# EAGLE design VC8Evrs2 (EAGLE 6.6.0)

## Sheet 1 of 2
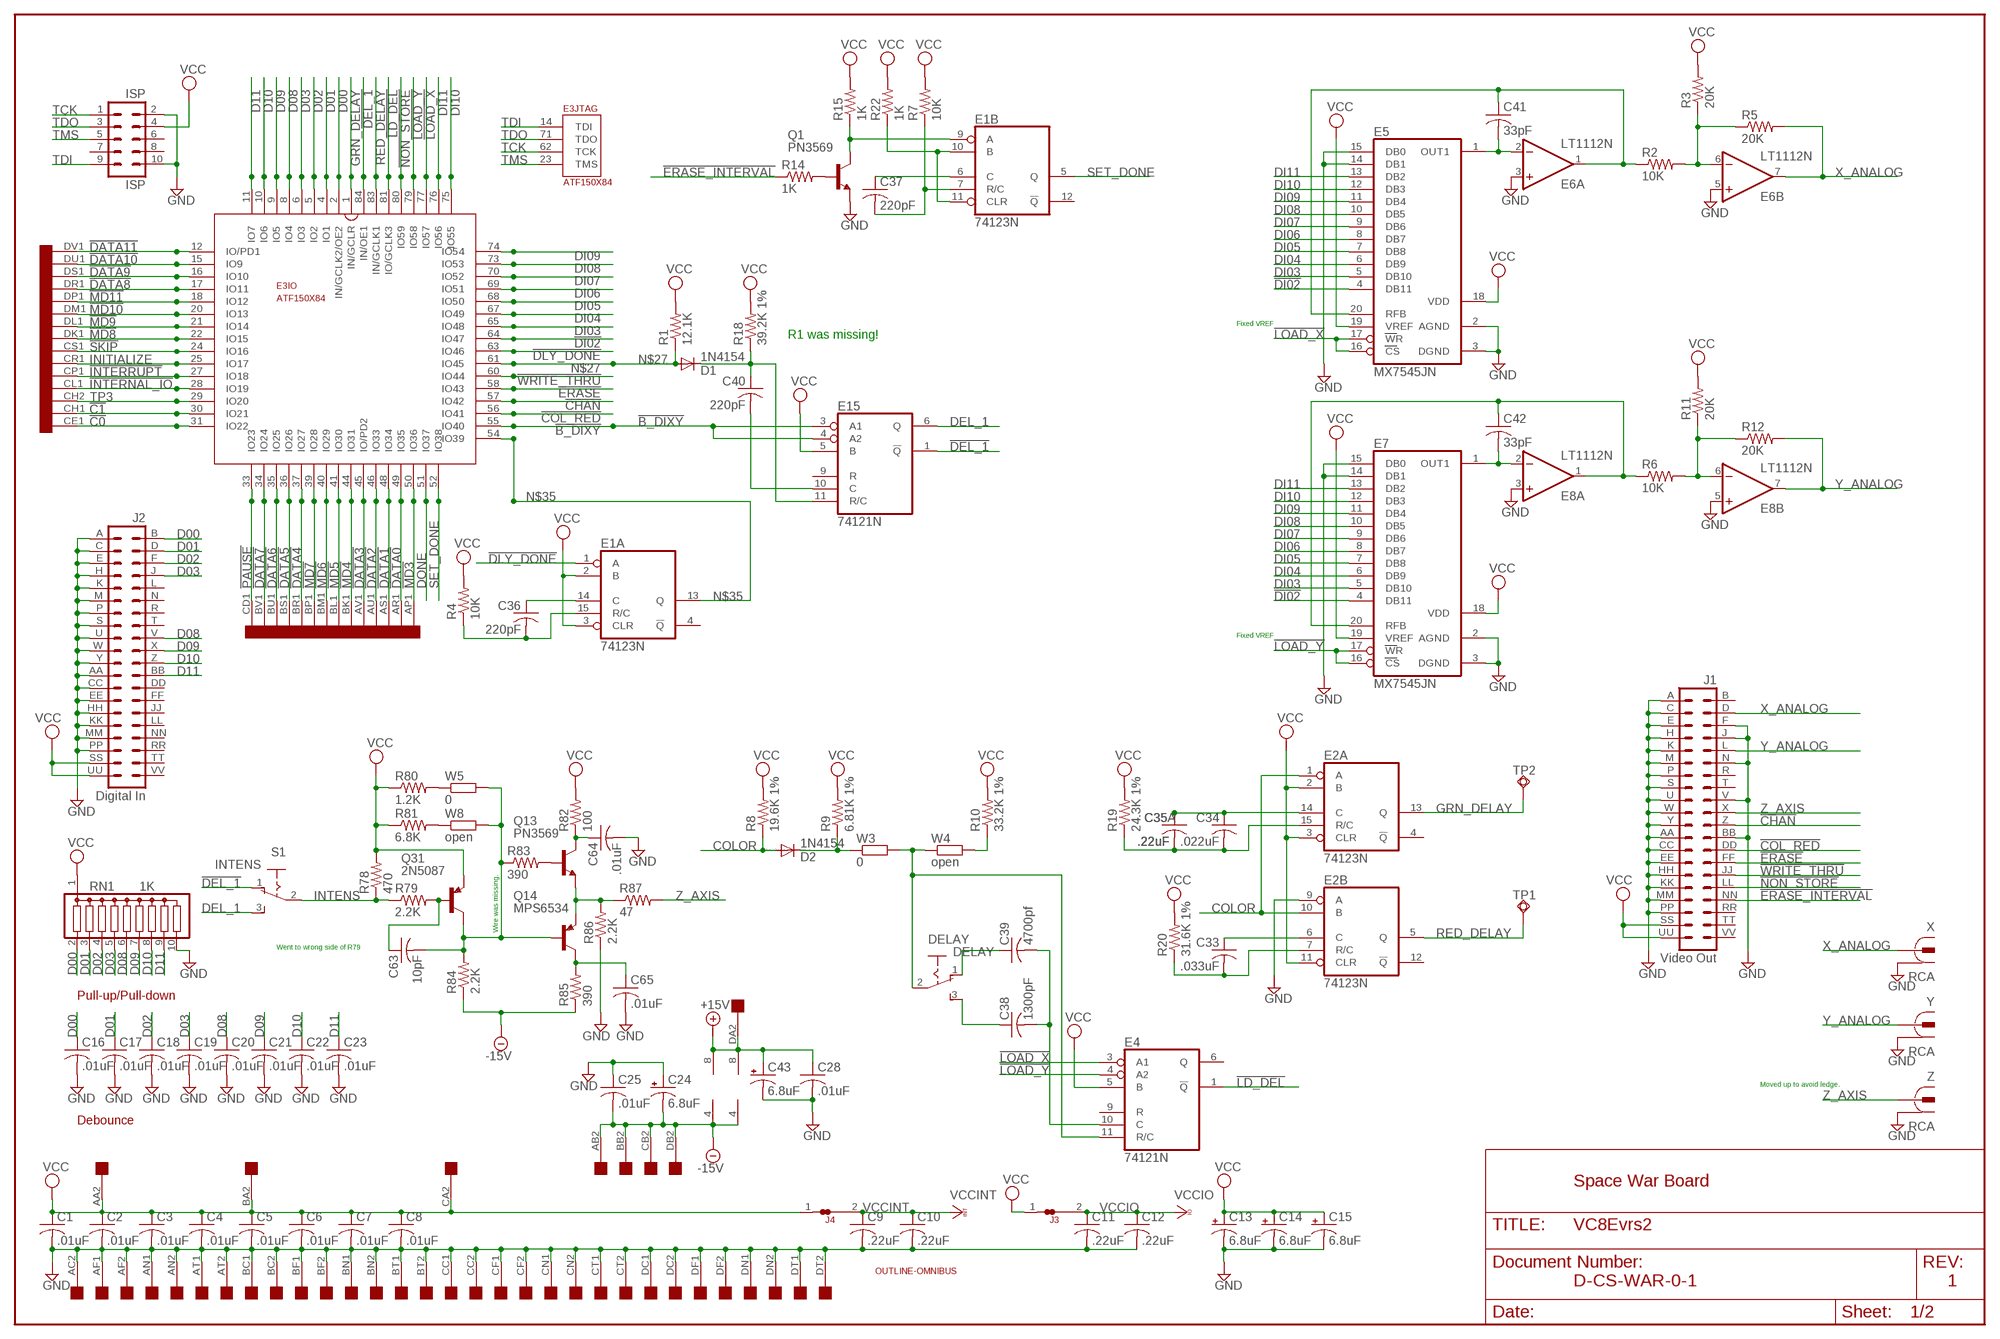
[diagram p0: schematic, sheet 1]

### Parts
C1  .01uF  C-US  [C063-025X075]
C2  .01uF  C-US  [C063-025X075]
C3  .01uF  C-US  [C063-025X075]
C4  .01uF  C-US  [C063-025X075]
C5  .01uF  C-US  [C063-025X075]
C6  .01uF  C-US  [C063-025X075]
C7  .01uF  C-US  [C063-025X075]
C8  .01uF  C-US  [C063-025X075]
C9  .22uF  C-US  [C063-025X075]
C10  .22uF  C-US  [C063-025X075]
C11  .22uF  C-US  [C063-025X075]
C12  .22uF  C-US  [C063-025X075]
C13  6.8uF  CPOL-USE20-8AXIAL  [E12-8]
C14  6.8uF  CPOL-USE20-8AXIAL  [E12-8]
C15  6.8uF  CPOL-USE20-8AXIAL  [E12-8]
C16  .01uF  C-US  [C063-025X075]
C17  .01uF  C-US  [C063-025X075]
C18  .01uF  C-US  [C063-025X075]
C19  .01uF  C-US  [C063-025X075]
C20  .01uF  C-US  [C063-025X075]
C21  .01uF  C-US  [C063-025X075]
C22  .01uF  C-US  [C063-025X075]
C23  .01uF  C-US  [C063-025X075]
C24  6.8uF  CPOL-USE20-8AXIAL  [E12-8]
C25  .01uF  C-US  [C063-025X075]
C28  .01uF  C-US  [C063-025X075]
C33  .033uF  C-US102-043X133  [C102-043X133]
C34  .022uF  C-US102-043X133  [C102-043X133]
C35  .22uF  C-US050-025X075  [C050-025X075]
C35A  .22uF  C-US102-043X133  [C102-043X133]
C36  220pF  C-US  [C063-025X075]
C37  220pF  C-US  [C063-025X075]
C38  1300pF  C-US150-054X183  [C150-054X183]
C39  4700pf  C-US102-043X133  [C102-043X133]
C40  220pF  C-US  [C063-025X075]
C41  33pF  C-US  [C063-025X075]
C42  33pF  C-US  [C063-025X075]
C43  6.8uF  CPOL-USE20-8AXIAL  [E12-8]
C63  10pF  C-US  [C063-025X075]
C64  .01uF  C-US  [C063-025X075]
C65  .01uF  C-US  [C063-025X075]
D1  1N4154  DIODE-DO35-10  [DO35-10]
D2  1N4154  DIODE-DO35-10  [DO35-10]
DELAY  DELAY  M251  [M251]
E1  74123N  [DIL16]
E2  74123N  [DIL16]
E3  ATF150X84  [S84]
E4  74121N  [DIL14]
E5  MX7545JN  [DIL20]
E6  LT1112N  LM1458N  [DIL08]
E7  MX7545JN  [DIL20]
E8  LT1112N  LM1458N  [DIL08]
E15  74121N  [DIL14]
ISP  ISP  ML10  [ML10]
J1  Video Out  DEC40PINH  [DEC40PINH]
J2  Digital In  DEC40PINH  [DEC40PINH]
J3  JUMPER-NC1  [NC1]
J4  JUMPER-NC1  [NC1]
OMNIBUS  QUAD  [EDGE-CON8]
Q1  PN3569  -NPN-TO5  [TO5]
Q13  PN3569  -NPN-TO5  [TO5]
Q14  MPS6534  -PNP-TO5  [TO5]
Q31  2N5087  -PNP-TO5  [TO5]
R1  12.1K  R-US_0207/15  [0207/15]
R2  10K  R-US_0207/10  [0207/10]
R3  20K  R-US_0207/10  [0207/10]
R4  10K  R-US_0207/10  [0207/10]
R5  20K  R-US_0207/10  [0207/10]
R6  10K  R-US_0207/10  [0207/10]
R7  10K  R-US_0207/10  [0207/10]
R8  19.6K 1%  R-US_0207/15  [0207/15]
R9  6.81K 1%  R-US_0207/15  [0207/15]
R10  33.2K 1%  R-US_0207/15  [0207/15]
R11  20K  R-US_0207/10  [0207/10]
R12  20K  R-US_0207/10  [0207/10]
R14  1K  R-US_0207/10  [0207/10]
R15  1K  R-US_0207/10  [0207/10]
R18  39.2K 1%  R-US_0207/15  [0207/15]
R19  24.3K 1%  R-US_0207/15  [0207/15]
R20  31.6K 1%  R-US_0207/15  [0207/15]
R22  1K  R-US_0207/10  [0207/10]
R78  470  R-US_0207/10  [0207/10]
R79  2.2K  R-US_0207/10  [0207/10]
R80  1.2K  R-US_0207/10  [0207/10]
R81  6.8K  R-US_0207/10  [0207/10]
R82  100  R-US_0207/10  [0207/10]
R83  390  R-US_0207/10  [0207/10]
R84  2.2K  R-US_0207/10  [0207/10]
R85  390  R-US_0207/10  [0207/10]
R86  2.2K  R-US_0207/10  [0207/10]
R87  47  R-US_0207/10  [0207/10]
RN1  1K  G09R  [SIL10]
S1  INTENS  M251  [M251]
TP1  TPSQPAD1-17  [P1-17]
TP2  TPSQPAD1-17  [P1-17]
U$1  OUTLINE-OMNIBUS  [OMNIBUS]
W3  0  R-EU_0207/10  [0207/10]
W4  open  R-EU_0207/10  [0207/10]
W5  0  R-EU_0207/10  [0207/10]
W8  open  R-EU_0207/10  [0207/10]
X  RCA  [RCA]
Y  RCA  [RCA]
Z  RCA  [RCA]

### Nets
!B_DIXY: E3.55(IO:IO40) E15.3(A1) E15.4(A2)
!C0: E3.31(IO:IO22) OMNIBUS.CE1
!C1: E3.30(IO:IO21) OMNIBUS.CH1
!CHAN: E3.57(IO:IO42) J1.Z
!COL_RED: E3.56(IO:IO41) J1.DD
!DATA0: E3.49(IO:IO35) OMNIBUS.AR1
!DATA1: E3.48(IO:IO34) OMNIBUS.AS1
!DATA2: E3.46(IO:IO33) OMNIBUS.AU1
!DATA3: E3.45(IO:IO/PD2) OMNIBUS.AV1
!DATA4: E3.37(IO:IO27) OMNIBUS.BR1
!DATA5: E3.36(IO:IO26) OMNIBUS.BS1
!DATA6: E3.35(IO:IO25) OMNIBUS.BU1
!DATA7: E3.34(IO:IO24) OMNIBUS.BV1
!DATA8: E3.17(IO:IO11) OMNIBUS.DR1
!DATA9: E3.16(IO:IO10) OMNIBUS.DS1
!DATA10: E3.15(IO:IO9) OMNIBUS.DU1
!DATA11: E3.12(IO:IO/PD1) OMNIBUS.DV1
!DEL_1: E3.84(IO:IN/OE1) E15.1(!Q) S1.1(O)
!DI02: E3.64(IO:IO47) E5.4(DB11) E7.4(DB11)
!DLY_DONE: E1.1(A:A) E3.63(IO:IO46)
!ERASE: E3.58(IO:IO43) J1.FF
!ERASE_INTERVAL: J1.NN R14.1
!INTERNAL_IO: E3.28(IO:IO19) OMNIBUS.CL1
!INTERRUPT: E3.27(IO:IO18) OMNIBUS.CP1
!LD_DEL: E3.81(IO:IO/GCLK3) E4.1(!Q)
!LOAD_X: E3.77(IO:IO57) E4.3(A1) E5.16(CS) E5.17(WR)
!LOAD_Y: E3.79(IO:IO58) E4.4(A2) E7.16(CS) E7.17(WR)
!MD3: E3.50(IO:IO36) OMNIBUS.AP1
!MD4: E3.44(IO:IO31) OMNIBUS.BK1
!MD5: E3.41(IO:IO30) OMNIBUS.BL1
!MD6: E3.40(IO:IO29) OMNIBUS.BM1
!MD7: E3.39(IO:IO28) OMNIBUS.BP1
!MD8: E3.22(IO:IO15) OMNIBUS.DK1
!MD9: E3.21(IO:IO14) OMNIBUS.DL1
!MD10: E3.20(IO:IO13) OMNIBUS.DM1
!MD11: E3.18(IO:IO12) OMNIBUS.DP1
!NON_STORE: E3.80(IO:IO59) J1.LL
!PAUSE: E3.33(IO:IO23) OMNIBUS.CD1
!SKIP: E3.24(IO:IO16) OMNIBUS.CS1
!WRITE_THRU: E3.60(IO:IO44) J1.JJ
+15V [supply]: C28.1 C43.+ E6.8(P:V+) E8.8(P:V+) OMNIBUS.DA2
-15V [supply]: C24.- C25.2 E6.4(P:V-) E8.4(P:V-) OMNIBUS.AB2 OMNIBUS.BB2 OMNIBUS.CB2 OMNIBUS.DB2 R84.1 R85.1
COLOR: D2.A E2.1(A:A) E2.10(B:B) R8.1
D00: C16.1 E3.2(IO:IN/GCLK2/OE2) J2.B RN1.2
D01: C17.1 E3.4(IO:IO1) J2.D RN1.3
D02: C18.1 E3.5(IO:IO2) J2.F RN1.4
D03: C19.1 E3.6(IO:IO3) J2.J RN1.5
D08: C20.1 E3.8(IO:IO4) J2.V RN1.6
D09: C21.1 E3.9(IO:IO5) J2.X RN1.7
D10: C22.1 E3.10(IO:IO6) J2.Z RN1.8
D11: C23.1 E3.11(IO:IO7) J2.BB RN1.9
DEL_1: E15.6(Q) S1.3(S)
DI03: E3.65(IO:IO48) E5.5(DB10) E7.5(DB10)
DI04: E3.67(IO:IO49) E5.6(DB9) E7.6(DB9)
DI05: E3.68(IO:IO50) E5.7(DB8) E7.7(DB8)
DI06: E3.69(IO:IO51) E5.8(DB7) E7.8(DB7)
DI07: E3.70(IO:IO52) E5.9(DB6) E7.9(DB6)
DI08: E3.73(IO:IO53) E5.10(DB5) E7.10(DB5)
DI09: E3.74(IO:IO54) E5.11(DB4) E7.11(DB4)
DI10: E3.75(IO:IO55) E5.12(DB3) E7.12(DB3)
DI11: E3.76(IO:IO56) E5.13(DB2) E7.13(DB2)
DONE: E3.51(IO:IO37)
GND [supply]: C1.2 C2.2 C3.2 C4.2 C5.2 C6.2 C7.2 C8.2 C9.2 C10.2 C11.2 C12.2 C13.- C14.- C15.- C16.2 C17.2 C18.2 C19.2 C20.2 C21.2 C22.2 C23.2 C24.+ C25.1 C28.2 C43.- C64.2 C65.2 E2.9(B:A) E5.2(AGND) E5.3(DGND) E5.14(DB1) E5.15(DB0) E6.3(A:+IN) E6.5(B:+IN) E7.2(AGND) E7.3(DGND) E7.14(DB1) E7.15(DB0) E8.3(A:+IN) E8.5(B:+IN) ISP.2 ISP.10 J1.A J1.AA J1.BB J1.C J1.CC J1.E J1.EE J1.F J1.H J1.HH J1.J J1.K J1.KK J1.M J1.MM J1.N J1.P J1.PP J1.S J1.U J1.V J1.W J1.Y J2.A J2.AA J2.C J2.CC J2.E J2.EE J2.H J2.HH J2.K J2.KK J2.M J2.MM J2.P J2.PP J2.S J2.U J2.W J2.Y OMNIBUS.AC2 OMNIBUS.AF1 OMNIBUS.AF2 OMNIBUS.AN1 OMNIBUS.AN2 OMNIBUS.AT1 OMNIBUS.AT2 OMNIBUS.BC1 OMNIBUS.BC2 OMNIBUS.BF1 OMNIBUS.BF2 OMNIBUS.BN1 OMNIBUS.BN2 OMNIBUS.BT1 OMNIBUS.BT2 OMNIBUS.CC1 OMNIBUS.CC2 OMNIBUS.CF1 OMNIBUS.CF2 OMNIBUS.CN1 OMNIBUS.CN2 OMNIBUS.CT1 OMNIBUS.CT2 OMNIBUS.DC1 OMNIBUS.DC2 OMNIBUS.DF1 OMNIBUS.DF2 OMNIBUS.DN1 OMNIBUS.DN2 OMNIBUS.DT1 OMNIBUS.DT2 Q1.1(E) R86.1 RN1.10 X.1 X.1@1 X.1@2 Y.1 Y.1@1 Y.1@2 Z.1 Z.1@1 Z.1@2
GRN_DELAY: E2.13(A:Q) E3.1(IO:IN/GCLR) TP2.TP
INITIALIZE: E3.25(IO:IO17) OMNIBUS.CR1
INTENS: R78.1 R79.1 S1.2(P)
N$1: C41.2 E5.1(OUT1) E6.2(A:-IN)
N$2: E6.6(B:-IN) R2.2 R3.1 R5.1
N$3: C41.1 E5.20(RFB) E6.1(A:OUT) R2.1
N$4: C39.1 DELAY.1(O)
N$5: C42.2 E7.1(OUT1) E8.2(A:-IN)
N$6: E8.6(B:-IN) R6.2 R11.1 R12.1
N$7: C42.1 E7.20(RFB) E8.1(A:OUT) R6.1
N$27: D1.A E3.61(IO:IO45) R1.1
N$28: C40.1 D1.C E15.11(R/C) R18.1
N$29: C40.2 E15.10(C)
N$30: C34.2 C35.2 C35A.2 E2.15(A:R/C) R19.1
N$31: C33.2 E2.7(B:R/C) R20.1
N$32: C33.1 E2.6(B:C)
N$33: C34.1 C35.1 C35A.1 E2.14(A:C)
N$35: E1.13(A:Q) E3.54(IO:IO39)
N$36: C36.2 E1.15(A:R/C) R4.1
N$37: C36.1 E1.14(A:C)
N$38: Q1.2(B) R14.2
N$39: E1.9(B:A) Q1.3(C) R15.1
N$40: E1.10(B:B) E1.11(B:CLR) R22.1
N$41: C37.2 E1.7(B:R/C) R7.1
N$42: C37.1 E1.6(B:C)
N$44: D2.C R9.1 W3.1
N$45: DELAY.2(P) E4.11(R/C) W3.2 W4.1
N$46: R10.1 W4.2
N$48: C38.1 DELAY.3(S)
N$49: C38.2 C39.2 E4.10(C)
N$153: C63.1 Q31.2(B) R79.2
N$154: C63.2 Q14.2(B) Q31.3(C) R83.1 R84.2 W5.2 W8.2
N$156: C65.1 Q14.3(C) R85.2
N$157: Q13.1(E) Q14.1(E) R86.2 R87.1
N$158: R80.2 W5.1
N$159: R81.2 W8.1
N$160: Q13.2(B) R83.2
N$162: C64.1 Q13.3(C) R82.1
RED_DELAY: E2.5(B:Q) E3.83(IO:IN/GCLK1) TP1.TP
SET_DONE: E1.5(B:Q) E3.52(IO:IO38)
TCK: E3.62(JTAG:TCK) ISP.1
TDI: E3.14(JTAG:TDI) ISP.9
TDO: E3.71(JTAG:TDO) ISP.3
TMS: E3.23(JTAG:TMS) ISP.5
TP3: E3.29(IO:IO20) OMNIBUS.CH2
VCC [supply]: C1.1 C2.1 C3.1 C4.1 C5.1 C6.1 C7.1 C8.1 C13.+ C14.+ C15.+ E1.2(A:B) E1.3(A:CLR) E2.2(A:B) E2.3(A:CLR) E2.11(B:CLR) E4.5(B) E5.18(VDD) E5.19(VREF) E7.18(VDD) E7.19(VREF) E15.5(B) ISP.4 J1.SS J1.UU J2.SS J2.UU J3.1 J4.1 OMNIBUS.AA2 OMNIBUS.BA2 OMNIBUS.CA2 Q31.1(E) R1.2 R3.2 R4.2 R7.2 R8.2 R9.2 R10.2 R11.2 R15.2 R18.2 R19.2 R20.2 R22.2 R78.2 R80.1 R81.1 R82.2 RN1.1
VCCINT [supply]: C9.1 C10.1 J4.2
VCCIO [supply]: C11.1 C12.1 J3.2
X_ANALOG: E6.7(B:OUT) J1.D R5.2 X.2
Y_ANALOG: E8.7(B:OUT) J1.L R12.2 Y.2
Z_AXIS: J1.X R87.2 Z.2
Unconnected: E1.4(A:!Q) E1.12(B:!Q) E2.4(A:!Q) E2.12(B:!Q) E4.6(Q) E4.9(R) E15.9(R) ISP.6 ISP.7 ISP.8 J1.B J1.R J1.RR J1.T J1.TT J1.VV J2.DD J2.FF J2.JJ J2.L J2.LL J2.N J2.NN J2.R J2.RR J2.T J2.TT J2.VV OMNIBUS.AA1 OMNIBUS.AB1 OMNIBUS.AC1 OMNIBUS.AD1 OMNIBUS.AD2 OMNIBUS.AE1 OMNIBUS.AE2 OMNIBUS.AH1 OMNIBUS.AH2 OMNIBUS.AJ1 OMNIBUS.AJ2 OMNIBUS.AK1 OMNIBUS.AK2 OMNIBUS.AL1 OMNIBUS.AL2 OMNIBUS.AM1 OMNIBUS.AM2 OMNIBUS.AP2 OMNIBUS.AR2 OMNIBUS.AS2 OMNIBUS.AU2 OMNIBUS.AV2 OMNIBUS.BA1 OMNIBUS.BB1 OMNIBUS.BD1 OMNIBUS.BD2 OMNIBUS.BE1 OMNIBUS.BE2 OMNIBUS.BH1 OMNIBUS.BH2 OMNIBUS.BJ1 OMNIBUS.BJ2 OMNIBUS.BK2 OMNIBUS.BL2 OMNIBUS.BM2 OMNIBUS.BP2 OMNIBUS.BR2 OMNIBUS.BS2 OMNIBUS.BU2 OMNIBUS.BV2 OMNIBUS.CA1 OMNIBUS.CB1 OMNIBUS.CD2 OMNIBUS.CE2 OMNIBUS.CJ1 OMNIBUS.CJ2 OMNIBUS.CK1 OMNIBUS.CK2 OMNIBUS.CL2 OMNIBUS.CM1 OMNIBUS.CM2 OMNIBUS.CP2 OMNIBUS.CR2 OMNIBUS.CS2 OMNIBUS.CU1 OMNIBUS.CU2 OMNIBUS.CV1 OMNIBUS.CV2 OMNIBUS.DA1 OMNIBUS.DB1 OMNIBUS.DD1 OMNIBUS.DD2 OMNIBUS.DE1 OMNIBUS.DE2 OMNIBUS.DH1 OMNIBUS.DH2 OMNIBUS.DJ1 OMNIBUS.DJ2 OMNIBUS.DK2 OMNIBUS.DL2 OMNIBUS.DM2 OMNIBUS.DP2 OMNIBUS.DR2 OMNIBUS.DS2 OMNIBUS.DU2 OMNIBUS.DV2

### Notes on the sheet
- Fixed VREF
- R1 was missing!
- Fixed VREF
- Wire was missing.
- Went to wrong side of R79
- Pull-up/Pull-down
- Moved up to avoid ledge.
- Debounce
- Space War Board
- D-CS-WAR-0-1 | 1

## Sheet 2 of 2

## Power pins joined to a net without a drawn wire
GND: E1.8(P:GND) E2.8(P:GND) E3.7(GND) E3.19(GND) E3.32(GND) E3.42(GND) E3.47(GND) E3.59(GND) E3.72(GND) E3.82(GND) E4.7(GND) E15.7(GND)
VCC: E1.16(P:VCC) E2.16(P:VCC) E4.14(VCC) E15.14(VCC)
VCCINT: E3.3(VCCINT) E3.43(VCCINT)
VCCIO: E3.13(VCCIO) E3.26(VCCIO) E3.38(VCCIO) E3.53(VCCIO) E3.66(VCCIO) E3.78(VCCIO)

## Library data of the parts
C1-C12 C16-C23 C25 C28 C36 C37 C40-C42 C63-C65 = dec-con:C-US: Capacitors with funky DEC lead spacing.
C13-C15 C24 C43 = dec-con:CPOL-USE20-8AXIAL: A 0.8 inch electrolytic.
C33-C35 C35A C38 C39 = rcl:C-US: CAPACITOR, American symbol
D1 D2 = diode:DIODE-: DIODE
DELAY S1 = switch:M251: SLIDING SWITCH Mors, distributor Buerklin, 11G702
E1 E2 = 74xx-us:74*123: Retriggerable monostable MULTIVIBRATOR
E3 = atmel-cpld:ATF150X84: ATF150x in 84 pin package.
E4 E15 = 74xx-us:74*121: Monostable MULTIVIBRATOR, schmitt trigger inputs
E5 E7 = maxim:MX7545JN: DIGITAL/ANALOG CONVERTER; MPN: MX7545JN+; OC_FARNELL: unknown; OC_NEWARK: 61K1015
E6 E8 = linear:*1458: OP AMP
ISP = con-harting-ml:ML10: HARTING; OC_FARNELL: unknown; OC_NEWARK: unknown
J1 J2 = dec-con:DEC40PIN: PIN HEADER
J3 J4 = dec-con:JUMPER: Normally closed SMD Jumper (Generates a DRC error.)
OMNIBUS = dec-con:QUAD: Quad-Height DEC board
Q1 Q13 = transistor:*-NPN-: NPN Transistror BF959 corrected 2008.03.06
Q14 Q31 = transistor:*-PNP-: PNP Transistror
R1-R12 R14 R15 R18-R20 R22 R78-R87 = rcl:R-US_: RESISTOR, American symbol
RN1 = resistor-sil:G09R: SIL RESISTOR; OC_FARNELL: unknown; OC_NEWARK: unknown
TP1 TP2 = testpad:TPSQ: Test pad
U$1 = dec-con:OUTLINE-*: Board outlines for DEC boards.
W3-W5 W8 = rcl:R-EU_: RESISTOR, European symbol
X Y Z = dec-con:RCA: RCA Jack

## Net classes
1 supply: width 0.686 mm

## Board
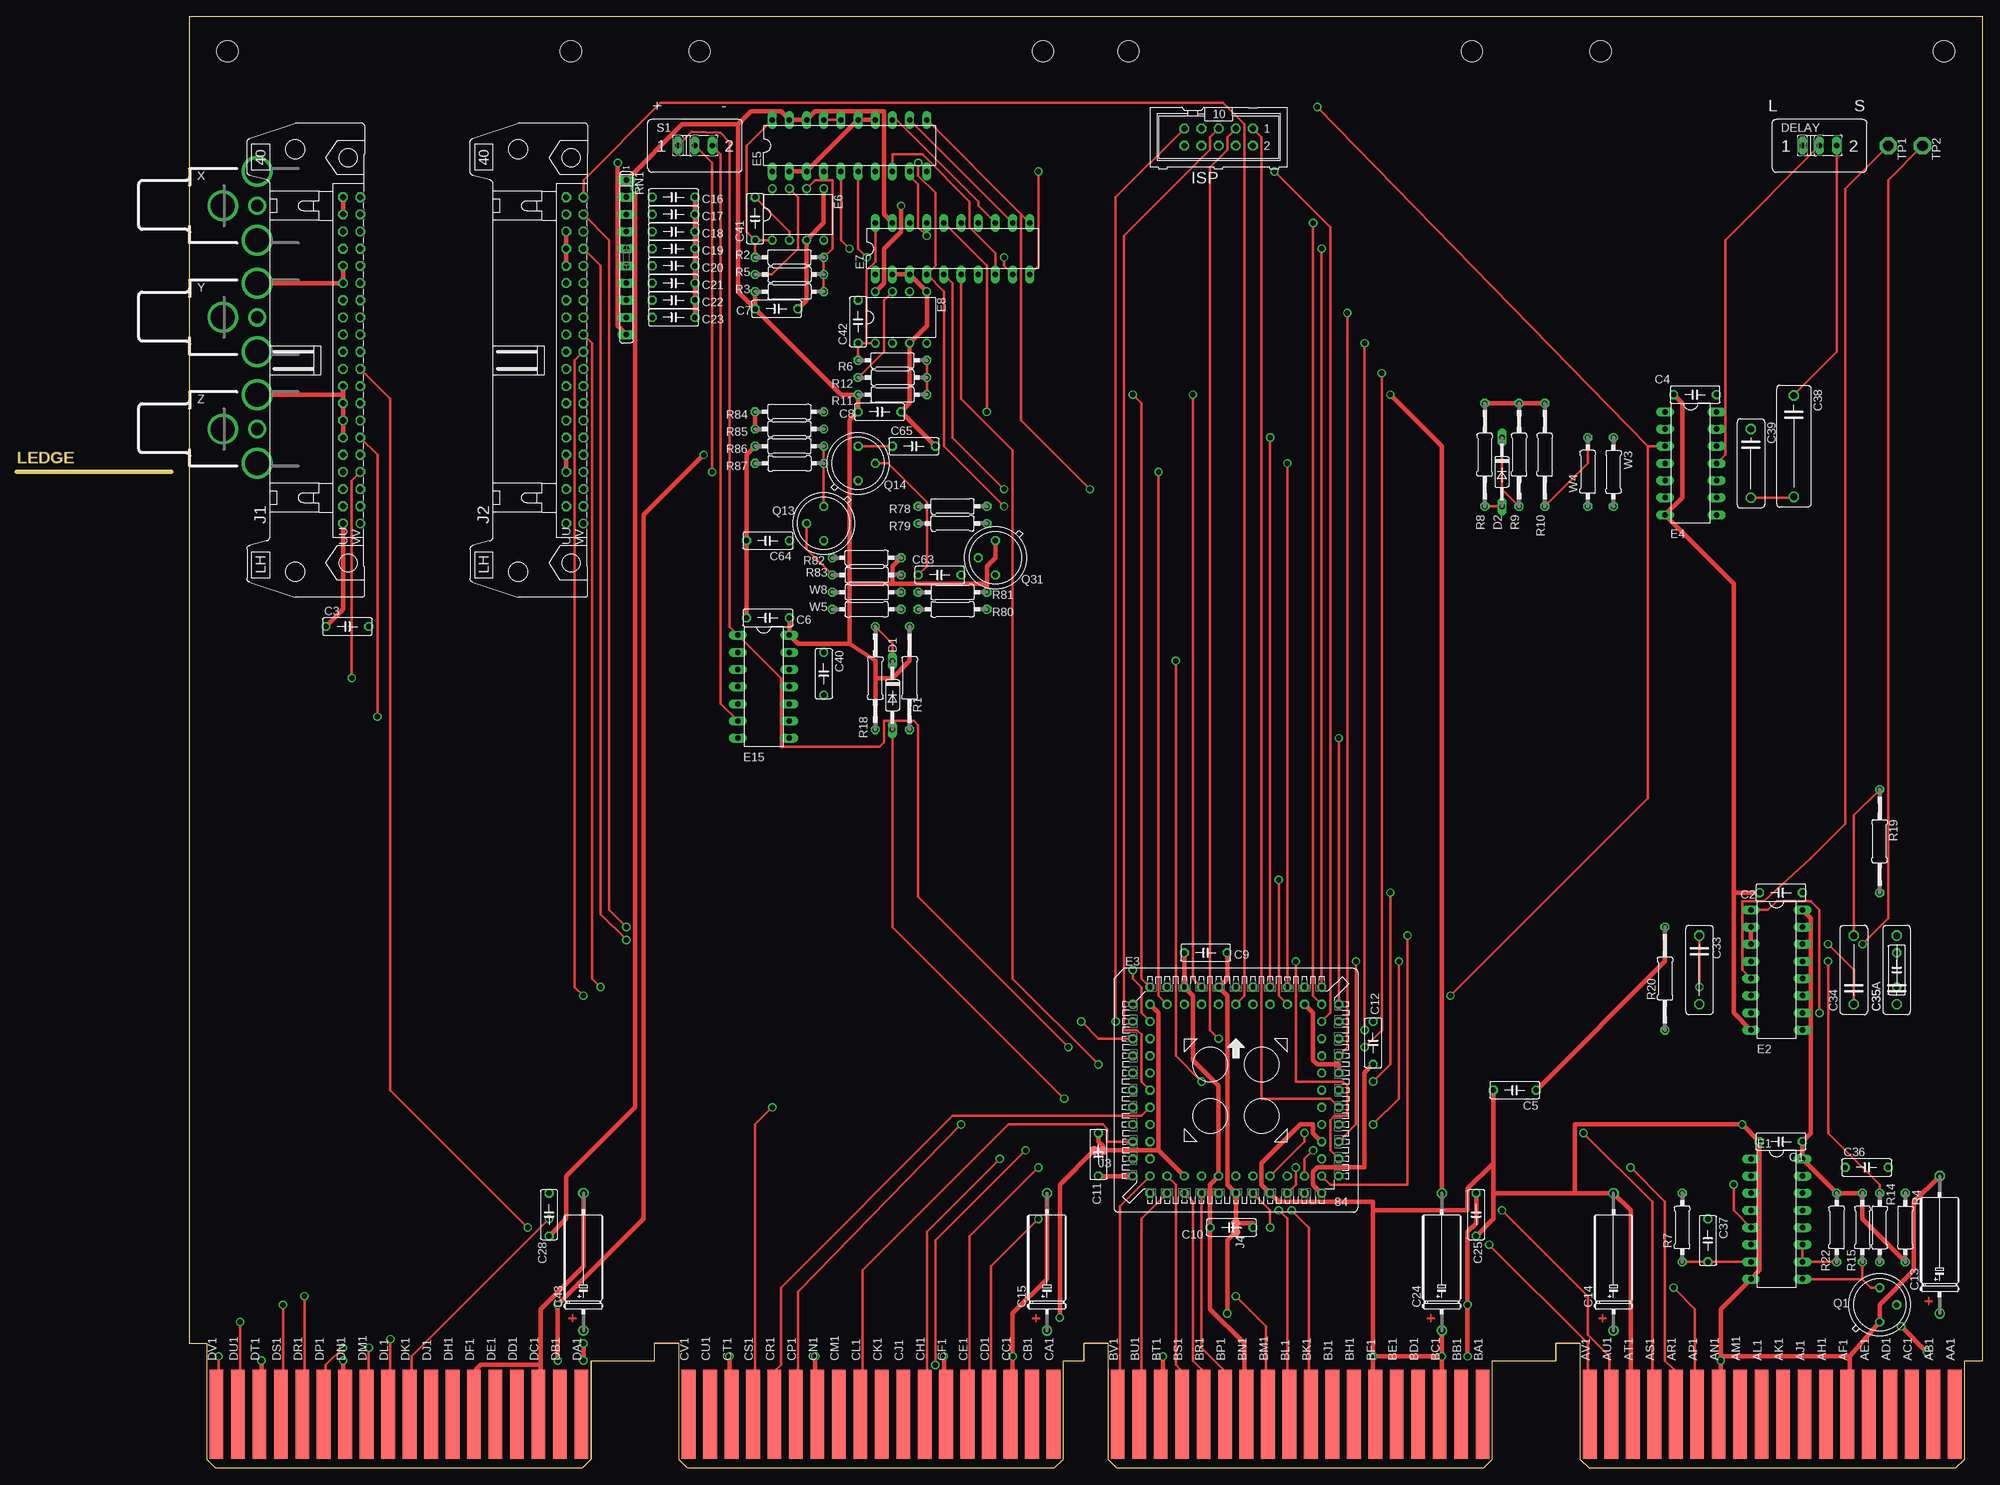
[diagram p1: board, top side]
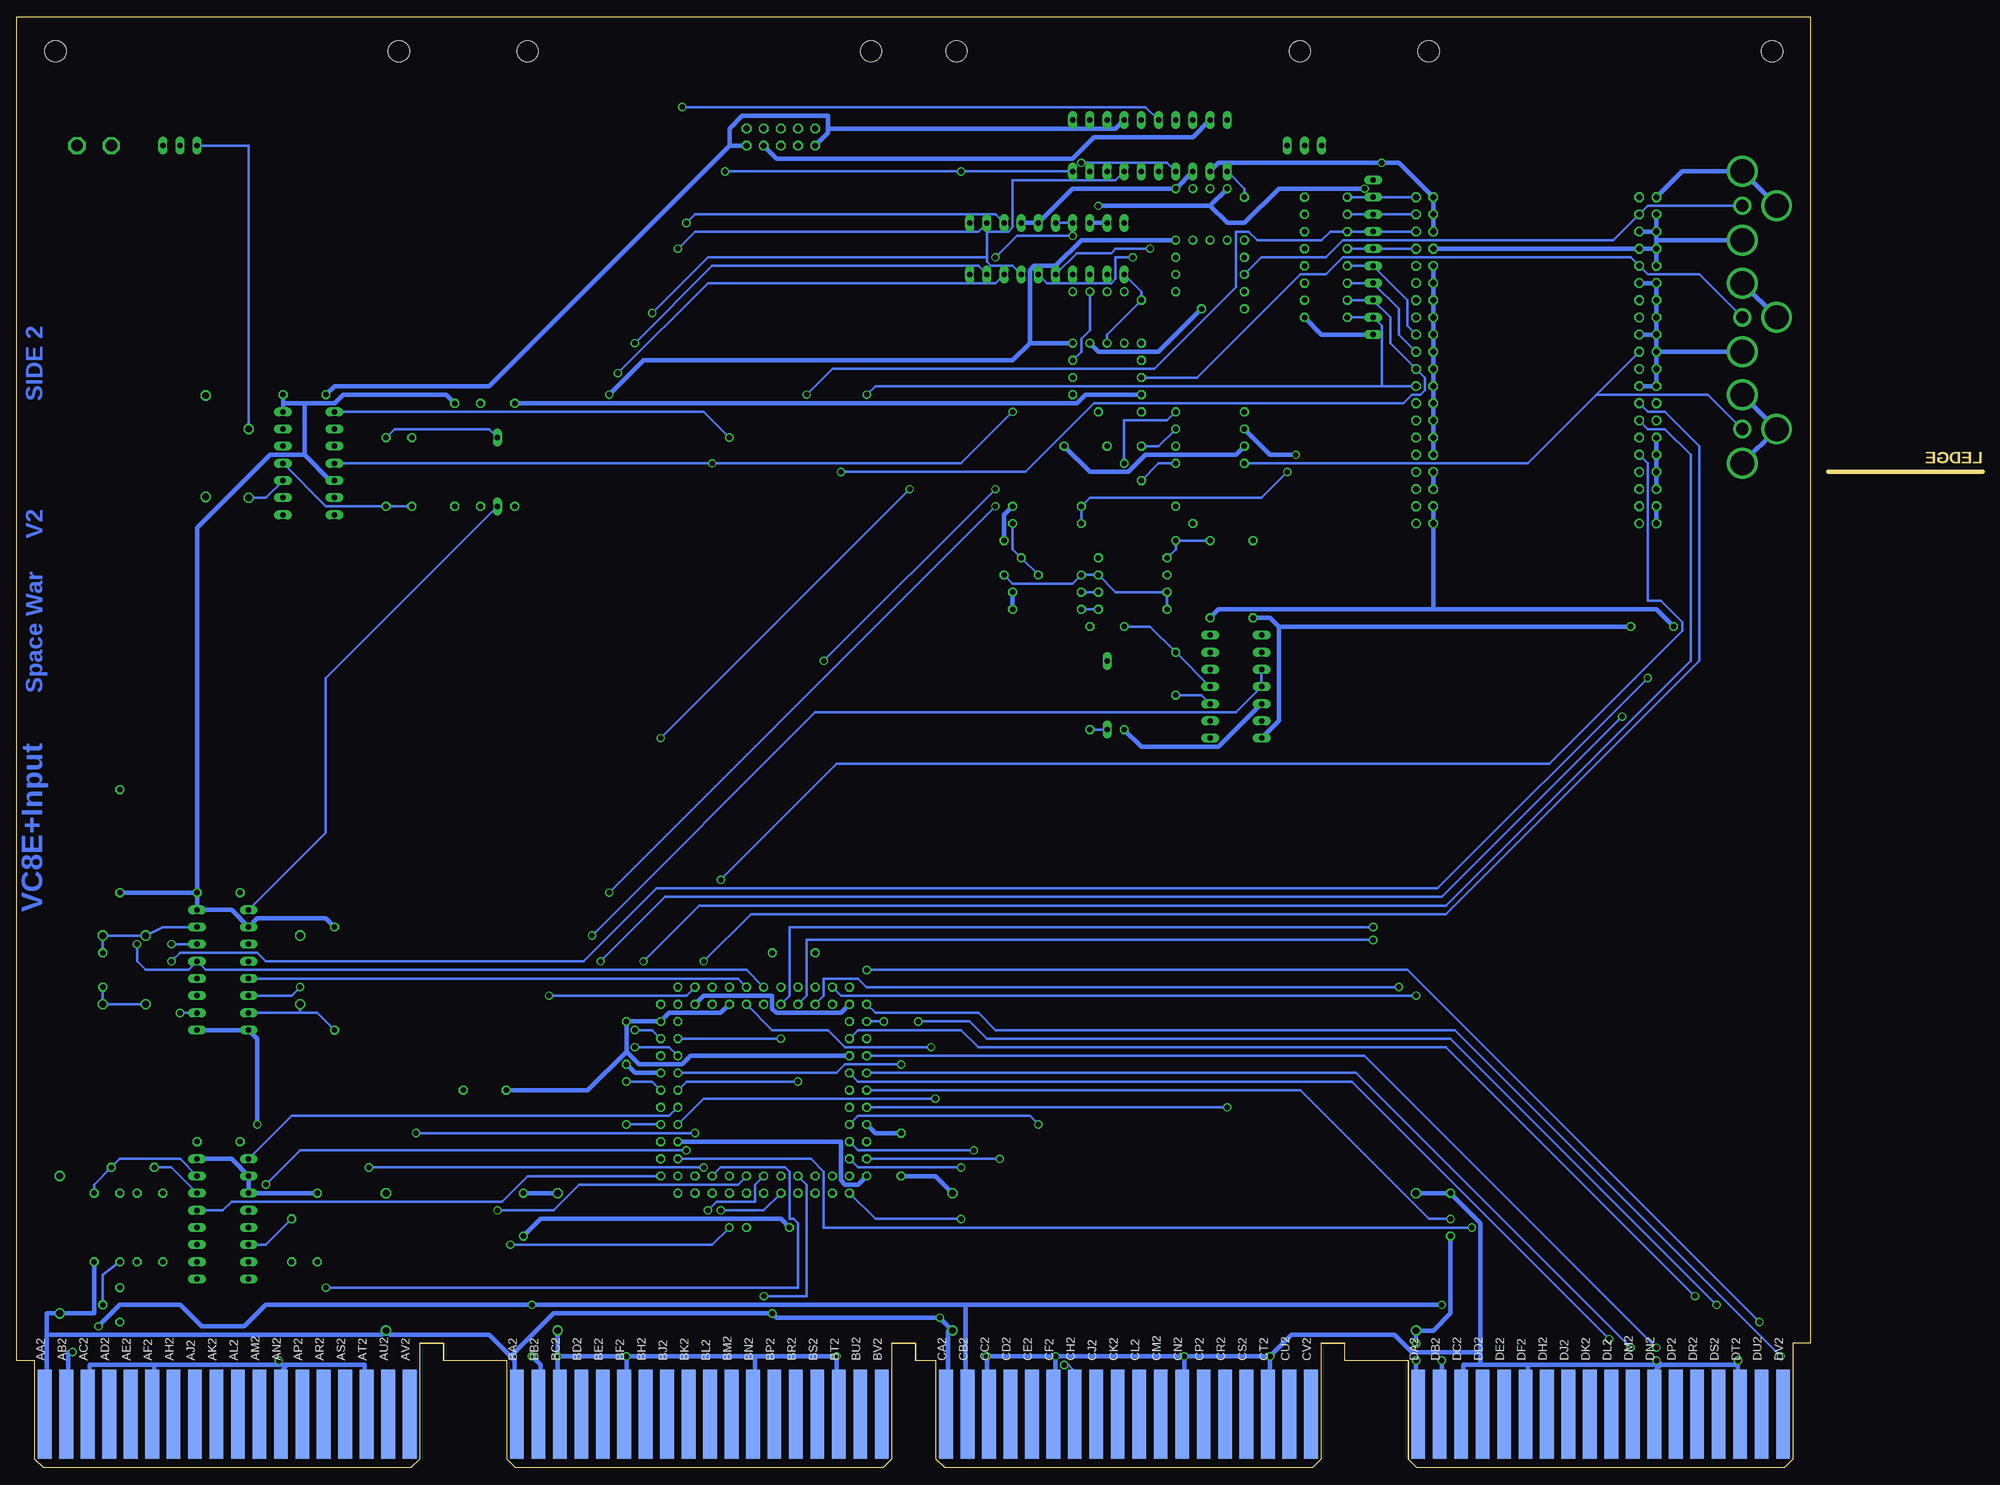
[diagram p2: board, bottom side, seen from below]

Size 290.83 x 214.63 mm. Coordinates in mm from the lower left corner, seen from the top.
Outline: 22.86,147.32 0,147.32
Copper layers (1+2+15+16): Top 0.035mm / dielectric 1.5mm / ECO1 0.035mm / dielectric 0.15mm / ECO2 0.035mm / dielectric 0.2mm / Bottom 0.035mm
Design rules "16mils *": minimum track width 16mil, minimum drill 32mil, track to track 12.5mil, track to pad 10mil, pad to pad 10mil, via to via 10mil, smd to smd 10mil, copper to edge 13mil, drill to drill 10mil, minimum pad ring 10mil, minimum via ring 8mil, stop-mask expansion 0mil, vias tented up to drill 0mil, thermal gap 10mil

### Footprints (pad centres in the part's own frame; a part is rotated, then mirrored left to right if it is on the bottom)
C063-025X075 = drill 0.813 octagon: 1 -2.54,0; 2 3.81,0
E12-8 = drill 1.016: + -10.16,0 | drill 1.016 octagon: - 10.16,0
C102-043X133 = drill 1.016 octagon: 1 -5.08,0; 2 5.08,0
C050-025X075 = drill 0.813 octagon: 1 -2.54,0; 2 2.54,0
C150-054X183 = drill 1.016 octagon: 1 -7.493,0; 2 7.493,0
DO35-10 = drill 0.813 long: A 5.08,0; C -5.08,0
M251 = drill 0.813 long: 1 -2.54,0; 2 0,0; 3 2.54,0
DIL16 = drill 0.813 long: 1 -8.89,-3.81; 2 -6.35,-3.81; 3 -3.81,-3.81; 4 -1.27,-3.81; 5 1.27,-3.81; 6 3.81,-3.81; 7 6.35,-3.81; 8 8.89,-3.81; 9 8.89,3.81; 10 6.35,3.81; 11 3.81,3.81; 12 1.27,3.81; 13 -1.27,3.81; 14 -3.81,3.81; 15 -6.35,3.81; 16 -8.89,3.81
S84 = drill 0.813: 1 0,15.24 | drill 0.813 octagon: 2 0,12.7; 3 -2.54,15.24; 4 -2.54,12.7; 5 -5.08,15.24; 6 -5.08,12.7; 7 -7.62,15.24; 8 -7.62,12.7; 9 -10.16,15.24; 10 -10.16,12.7; 11 -12.7,15.24; 12 -15.24,12.7; 13 -12.7,12.7; 14 -15.24,10.16; 15 -12.7,10.16; 16 -15.24,7.62; 17 -12.7,7.62; 18 -15.24,5.08; 19 -12.7,5.08; 20 -15.24,2.54; 21 -12.7,2.54; 22 -15.24,0; 23 -12.7,0; 24 -15.24,-2.54; 25 -12.7,-2.54; 26 -15.24,-5.08; 27 -12.7,-5.08; 28 -15.24,-7.62; 29 -12.7,-7.62; 30 -15.24,-10.16; 31 -12.7,-10.16; 32 -15.24,-12.7; 33 -12.7,-15.24; 34 -12.7,-12.7; 35 -10.16,-15.24; 36 -10.16,-12.7; 37 -7.62,-15.24; 38 -7.62,-12.7; 39 -5.08,-15.24; 40 -5.08,-12.7; 41 -2.54,-15.24; 42 -2.54,-12.7; 43 0,-15.24; 44 0,-12.7; 45 2.54,-15.24; 46 2.54,-12.7; 47 5.08,-15.24; 48 5.08,-12.7; 49 7.62,-15.24; 50 7.62,-12.7; 51 10.16,-15.24; 52 10.16,-12.7; 53 12.7,-15.24; 54 15.24,-12.7; 55 12.7,-12.7; 56 15.24,-10.16; 57 12.7,-10.16; 58 15.24,-7.62; 59 12.7,-7.62; 60 15.24,-5.08; 61 12.7,-5.08; 62 15.24,-2.54; 63 12.7,-2.54; 64 15.24,0; 65 12.7,0; 66 15.24,2.54; 67 12.7,2.54; 68 15.24,5.08; 69 12.7,5.08; 70 15.24,7.62; 71 12.7,7.62; 72 15.24,10.16; 73 12.7,10.16; 74 15.24,12.7; 75 12.7,15.24; 76 12.7,12.7; 77 10.16,15.24; 78 10.16,12.7; 79 7.62,15.24; 80 7.62,12.7; 81 5.08,15.24; 82 5.08,12.7; 83 2.54,15.24; 84 2.54,12.7
DIL14 = drill 0.813 long: 1 -7.62,-3.81; 2 -5.08,-3.81; 3 -2.54,-3.81; 4 0,-3.81; 5 2.54,-3.81; 6 5.08,-3.81; 7 7.62,-3.81; 8 7.62,3.81; 9 5.08,3.81; 10 2.54,3.81; 11 0,3.81; 12 -2.54,3.81; 13 -5.08,3.81; 14 -7.62,3.81
DIL20 = drill 0.813 long: 1 -11.43,-3.81; 2 -8.89,-3.81; 3 -6.35,-3.81; 4 -3.81,-3.81; 5 -1.27,-3.81; 6 1.27,-3.81; 7 3.81,-3.81; 8 6.35,-3.81; 9 8.89,-3.81; 10 11.43,-3.81; 11 11.43,3.81; 12 8.89,3.81; 13 6.35,3.81; 14 3.81,3.81; 15 1.27,3.81; 16 -1.27,3.81; 17 -3.81,3.81; 18 -6.35,3.81; 19 -8.89,3.81; 20 -11.43,3.81
DIL08 = drill 0.813 pad 1.27: 1 -3.81,-3.81; 2 -1.27,-3.81; 3 1.27,-3.81; 4 3.81,-3.81; 5 3.81,3.81; 6 1.27,3.81; 7 -1.27,3.81; 8 -3.81,3.81
ML10 = drill 0.914 octagon: 1 -5.08,-1.27; 2 -5.08,1.27; 3 -2.54,-1.27; 4 -2.54,1.27; 5 0,-1.27; 6 0,1.27; 7 2.54,-1.27; 8 2.54,1.27; 9 5.08,-1.27; 10 5.08,1.27
DEC40PINH = drill 0.914 octagon: A 24.13,1.27; AA -3.81,1.27; B 24.13,-1.27; BB -3.81,-1.27; C 21.59,1.27; CC -6.35,1.27; D 21.59,-1.27; DD -6.35,-1.27; E 19.05,1.27; EE -8.89,1.27; F 19.05,-1.27; FF -8.89,-1.27; H 16.51,1.27; HH -11.43,1.27; J 16.51,-1.27; JJ -11.43,-1.27; K 13.97,1.27; KK -13.97,1.27; L 13.97,-1.27; LL -13.97,-1.27; M 11.43,1.27; MM -16.51,1.27; N 11.43,-1.27; NN -16.51,-1.27; P 8.89,1.27; PP -19.05,1.27; R 8.89,-1.27; RR -19.05,-1.27; S 6.35,1.27; SS -21.59,1.27; T 6.35,-1.27; TT -21.59,-1.27; U 3.81,1.27; UU -24.13,1.27; V 3.81,-1.27; W 1.27,1.27; X 1.27,-1.27; Y -1.27,1.27; Z -1.27,-1.27 | drill 0.914: VV -24.13,-1.27
NC1 = smd 1.346 x 1.346: 1 -0.635,0; 2 0.635,0
EDGE-CON8 = smd 2.032 x 13.106: AA1 261.303,7.938; AB1 258.127,7.938; AC1 254.952,7.938; AD1 251.778,7.938; AE1 248.602,7.938; AF1 245.428,7.938; AH1 242.252,7.938; AJ1 239.077,7.938; AK1 235.903,7.938; AL1 232.727,7.938; AM1 229.553,7.938; AN1 226.377,7.938; AP1 223.202,7.938; AR1 220.028,7.938; AS1 216.852,7.938; AT1 213.678,7.938; AU1 210.502,7.938; AV1 207.327,7.938; BA1 191.452,7.938; BB1 188.278,7.938; BC1 185.102,7.938; BD1 181.928,7.938; BE1 178.752,7.938; BF1 175.577,7.938; BH1 172.403,7.938; BJ1 169.227,7.938; BK1 166.053,7.938; BL1 162.877,7.938; BM1 159.702,7.938; BN1 156.528,7.938; BP1 153.352,7.938; BR1 150.178,7.938; BS1 147.002,7.938; BT1 143.827,7.938; BU1 140.653,7.938; BV1 137.477,7.938; CA1 127.953,7.938; CB1 124.778,7.938; CC1 121.603,7.938; CD1 118.427,7.938; CE1 115.252,7.938; CF1 112.078,7.938; CH1 108.903,7.938; CJ1 105.728,7.938; CK1 102.552,7.938; CL1 99.377,7.938; CM1 96.203,7.938; CN1 93.028,7.938; CP1 89.853,7.938; CR1 86.677,7.938; CS1 83.502,7.938; CT1 80.328,7.938; CU1 77.153,7.938; CV1 73.978,7.938; DA1 58.102,7.938; DB1 54.928,7.938; DC1 51.752,7.938; DD1 48.578,7.938; DE1 45.403,7.938; DF1 42.227,7.938; DH1 39.053,7.938; DJ1 35.877,7.938; DK1 32.703,7.938; DL1 29.527,7.938; DM1 26.352,7.938; DN1 23.177,7.938; DP1 20.003,7.938; DR1 16.828,7.938; DS1 13.652,7.938; DT1 10.477,7.938; DU1 7.303,7.938; DV1 4.128,7.938 | smd 2.032 x 13.106 bottom: AA2 261.303,7.938; AB2 258.127,7.938; AC2 254.952,7.938; AD2 251.778,7.938; AE2 248.602,7.938; AF2 245.428,7.938; AH2 242.252,7.938; AJ2 239.077,7.938; AK2 235.903,7.938; AL2 232.727,7.938; AM2 229.553,7.938; AN2 226.377,7.938; AP2 223.202,7.938; AR2 220.028,7.938; AS2 216.852,7.938; AT2 213.678,7.938; AU2 210.502,7.938; AV2 207.327,7.938; BA2 191.452,7.938; BB2 188.278,7.938; BC2 185.102,7.938; BD2 181.928,7.938; BE2 178.752,7.938; BF2 175.577,7.938; BH2 172.403,7.938; BJ2 169.227,7.938; BK2 166.053,7.938; BL2 162.877,7.938; BM2 159.702,7.938; BN2 156.528,7.938; BP2 153.352,7.938; BR2 150.178,7.938; BS2 147.002,7.938; BT2 143.827,7.938; BU2 140.653,7.938; BV2 137.477,7.938; CA2 127.953,7.938; CB2 124.778,7.938; CC2 121.603,7.938; CD2 118.427,7.938; CE2 115.252,7.938; CF2 112.078,7.938; CH2 108.903,7.938; CJ2 105.728,7.938; CK2 102.552,7.938; CL2 99.377,7.938; CM2 96.203,7.938; CN2 93.028,7.938; CP2 89.853,7.938; CR2 86.677,7.938; CS2 83.502,7.938; CT2 80.328,7.938; CU2 77.153,7.938; CV2 73.978,7.938; DA2 58.102,7.938; DB2 54.928,7.938; DC2 51.752,7.938; DD2 48.578,7.938; DE2 45.403,7.938; DF2 42.227,7.938; DH2 39.053,7.938; DJ2 35.877,7.938; DK2 32.703,7.938; DL2 29.527,7.938; DM2 26.352,7.938; DN2 23.177,7.938; DP2 20.003,7.938; DR2 16.828,7.938; DS2 13.652,7.938; DT2 10.477,7.938; DU2 7.303,7.938; DV2 4.128,7.938
TO5 = drill 0.813 octagon: 1 0,-2.54; 2 2.54,0; 3 0,2.54
0207/15 = drill 0.813 octagon: 1 -7.62,0; 2 7.62,0
0207/10 = drill 0.813 octagon: 1 -5.08,0; 2 5.08,0
SIL10 = drill 0.813 long: 1 -11.43,0; 2 -8.89,0; 3 -6.35,0; 4 -3.81,0; 5 -1.27,0; 6 1.27,0; 7 3.81,0; 8 6.35,0; 9 8.89,0; 10 11.43,0
P1-17 = drill 1.702 pad 2.54 octagon: TP 0,0
OMNIBUS = hole 3.175: 208.915,209.55; 259.715,209.55; 189.865,209.55; 139.065,209.55; 75.616,209.55; 126.416,209.55; 56.566,209.55; 5.766,209.55
RCA = drill 3.556: 1 -5.08,0; 1@1 0,-5.08; 1@2 0,5.08 | drill 1.8: 2 0,0

### Placement (x,y rotation side)
C1  261.62,48.26 180 top
C2  261.62,85.09 180 top
C3  48.26,124.46 0 top
C4  248.92,158.75 180 top
C5  222.25,55.88 180 top
C6  111.76,125.73 180 top
C7  111.76,171.45 0 top
C8  127,156.21 0 top
C9  176.53,76.2 180 top
C10  180.34,35.56 180 top
C11  160.02,46.99 270 top
C12  200.66,62.23 90 top
C13  284.48,33.02 90 top
C14  236.22,30.48 90 top
C15  152.4,30.48 90 top
C16  96.52,187.96 0 top
C17  96.52,185.42 0 top
C18  96.52,182.88 0 top
C19  96.52,180.34 0 top
C20  96.52,177.8 0 top
C21  96.52,175.26 0 top
C22  96.52,172.72 0 top
C23  96.52,170.18 0 top
C24  210.82,30.48 90 top
C25  215.9,36.83 90 top
C28  78.74,36.83 90 top
C33  248.92,73.66 270 top
C34  271.78,73.66 90 top
C35  278.13,73.66 90 top
C35A  278.13,73.66 90 top
C36  273.05,44.45 0 top
C37  250.19,34.29 270 top
C38  262.89,151.13 270 top
C39  256.54,148.59 270 top
C40  119.38,118.11 270 top
C41  109.22,184.15 90 top
C42  124.46,168.91 90 top
C43  83.82,30.48 90 top
C63  137.16,132.08 180 top
C64  111.76,137.16 180 top
C65  132.08,151.13 0 top
D1  129.54,114.3 270 top
D2  219.71,147.32 270 top
DELAY  266.7,195.58 0 top
E1  260.35,36.83 270 top
E2  260.35,73.66 270 top
E3  180.34,55.88 0 top
E4  247.65,148.59 270 top
E5  123.19,195.58 0 top
E6  115.57,185.42 0 top
E7  138.43,180.34 0 top
E8  130.81,170.18 0 top
E15  110.49,115.57 270 top
ISP  177.8,196.85 180 top
J1  49.53,163.83 90 top
J2  82.55,163.83 90 top
J3  160.02,46.99 0 top
J4  180.34,35.56 90 top
OMNIBUS  25.4,0 0 top
Q1  275.59,24.13 0 top
Q13  119.38,139.7 180 top
Q14  124.46,148.59 0 top
Q31  144.78,134.62 180 top
R1  132.08,116.84 90 top
R2  114.3,179.07 0 top
R3  114.3,173.99 180 top
R4  279.4,35.56 270 top
R5  114.3,176.53 180 top
R6  129.54,163.83 0 top
R7  246.38,35.56 90 top
R8  217.17,149.86 90 top
R9  222.25,149.86 90 top
R10  226.06,149.86 90 top
R11  129.54,158.75 180 top
R12  129.54,161.29 180 top
R14  275.59,35.56 270 top
R15  273.05,35.56 90 top
R18  127,116.84 270 top
R19  275.59,92.71 270 top
R20  243.84,72.39 90 top
R22  269.24,35.56 90 top
R78  138.43,142.24 0 top
R79  138.43,139.7 0 top
R80  138.43,127 180 top
R81  138.43,129.54 180 top
R82  125.73,134.62 0 top
R83  125.73,132.08 180 top
R84  114.3,156.21 0 top
R85  114.3,153.67 0 top
R86  114.3,151.13 0 top
R87  114.3,148.59 180 top
RN1  90.17,179.07 270 top
S1  100.33,195.58 0 top
TP1  276.86,195.58 270 top
TP2  281.94,195.58 270 top
U$1  25.4,0 0 top
W3  236.22,147.32 270 top
W4  232.41,147.32 90 top
W5  125.73,127 180 top
W8  125.73,129.54 180 top
X  35.56,186.69 0 top
Y  35.56,170.18 0 top
Z  35.56,153.67 0 top

### Tracks (layer width: path | path; a pad name or v marks a point on that pad's centre or on a via)
!B_DIXY  (via drill 0.81)
  Top 0.406: E3.55 194.31,41.91 205.74,41.91 v205.74,78.74
  Bottom 0.406: E15.3 E15.4 110.49,111.76 172.72,111.76 v205.74,78.74
!C0  (via drill 0.81)
  Top 0.406: v151.13,44.45 140.97,34.29 140.97,8.26 OMNIBUS.CE1
  Bottom 0.406: E3.31 166.37,44.45 v151.13,44.45
!C1  (via drill 0.81)
  Top 0.406: v145.41,45.72 134.62,34.92 134.62,8.26 OMNIBUS.CH1
  Bottom 0.406: v145.41,45.72 E3.30
!CHAN  (via drill 0.81)
  Top 0.406: v75.56,35.56 55.24,55.88 55.24,158.12 J1.Z
  Bottom 0.406: E3.57 173.36,45.72 171.45,43.81 171.45,35.56 v75.56,35.56
!COL_RED  (via drill 0.81)
  Top 0.406: E3.56 194.31,46.99 194.31,51.44 194.94,52.07 196.85,52.07 196.85,56.52 196.22,57.15 189.23,57.15 v189.23,74.93
  Bottom 0.406: v189.23,74.93 182.25,81.92 79.38,81.92 41.91,119.38 41.91,151.13 46.99,156.21 49.53,156.21 J1.DD
!DATA0  (via drill 0.81)
  Top 0.406: E3.49 189.23,41.91 v189.23,44.45 | v238.76,44.45 243.84,39.37 243.84,15.88 245.11,14.61 245.11,8.26 OMNIBUS.AR1
  Bottom 0.406: v238.76,44.45 v189.23,44.45
!DATA1  (via drill 0.81)
  Top 0.406: E3.48 190.5,48.26 v190.5,49.53 | v231.78,49.53 241.94,39.37 241.94,8.26 OMNIBUS.AS1
  Bottom 0.406: v231.78,49.53 v190.5,49.53
!DATA2  (via drill 0.81)
  Top 0.406: v219.71,38.1 232.41,25.4 232.41,19.68 235.59,16.51 235.59,8.26 OMNIBUS.AU1
  Bottom 0.406: E3.46 184.15,41.91 207.65,41.91 211.46,38.1 v219.71,38.1
!DATA3  (via drill 0.81)
  Top 0.406: E3.45 185.42,38.1 v185.42,35.56 | v217.81,33.02 232.41,18.41 232.41,8.26 OMNIBUS.AV1
  Bottom 0.406: v185.42,35.56 187.96,33.02 v217.81,33.02
!DATA4
  Top 0.406: E3.37 173.99,39.37 173.99,15.88 175.26,14.61 175.26,8.26 OMNIBUS.BR1
!DATA5
  Top 0.406: E3.36 171.45,41.91 171.45,15.24 172.09,14.61 172.09,8.26 OMNIBUS.BS1
!DATA6
  Top 0.406: E3.35 166.37,36.83 166.37,8.26 OMNIBUS.BU1
!DATA7
  Top 0.406: E3.34 163.19,38.73 163.19,8.26 OMNIBUS.BV1
!DATA8  (via drill 0.81)
  Top 0.406: v42.55,25.4 42.55,8.26 OMNIBUS.DR1
  Bottom 0.406: E3.17 166.37,64.77 151.13,64.77 148.59,62.23 79.38,62.23 v42.55,25.4
!DATA9  (via drill 0.81)
  Top 0.406: E3.16 160.02,63.5 v157.48,66.04 | v39.37,24.13 39.37,8.26 OMNIBUS.DS1
  Bottom 0.406: v157.48,66.04 149.86,66.04 147.32,63.5 78.74,63.5 v39.37,24.13
!DATA10  (via drill 0.81)
  Top 0.406: E3.15 166.37,67.31 166.37,71.12 165.1,72.39 v165.1,73.66 | v33.02,21.59 33.02,8.26 OMNIBUS.DU1
  Bottom 0.406: v165.1,73.66 85.09,73.66 v33.02,21.59
!DATA11  (via drill 0.81)
  Top 0.406: v29.84,16.51 29.84,8.26 OMNIBUS.DV1
  Bottom 0.406: E3.12 163.83,67.31 148.59,67.31 146.05,64.77 78.1,64.77 v29.84,16.51
!DEL_1  (via drill 0.81)
  Top 0.406: S1.1 99.82,197.61 104.14,197.49 105.41,196.09 105.41,124.46 E15.1 113.03,116.84 113.03,106.68 127.63,106.68 128.27,107.31 128.27,110.49 132.72,110.49 133.35,109.86 133.35,84.45 v155.58,62.23
  Bottom 0.406: E3.84 179.07,64.77 170.81,64.77 168.28,62.23 v155.58,62.23
!DI02  (via drill 0.81)
  Top 0.406: v133.35,193.04 133.35,191.13 135.89,188.59 135.89,177.8 E7.4 137.16,173.99 137.16,151.13 v146.05,142.24 | v200.66,57.15 203.2,59.69 v203.2,85.09
  Bottom 0.406: v133.35,193.04 120.65,193.04 E5.4 | E3.64 196.85,57.15 v200.66,57.15 | v146.05,142.24 v203.2,85.09
!DLY_DONE
  Bottom 0.406: E1.1 250.19,52.07 194.31,52.07 E3.63
!ERASE  (via drill 0.81)
  Top 0.406: E3.58 198.12,50.8 v198.12,74.93
  Bottom 0.406: v198.12,74.93 189.87,83.19 79.38,83.19 43.18,119.38 43.18,149.86 46.99,153.67 49.53,153.67 J1.FF
!ERASE_INTERVAL  (via drill 0.81)
  Top 0.406: R14.1 275.59,41.91 267.97,49.53 v267.97,74.93 | v49.53,116.84 49.53,146.05 J1.NN
  Bottom 0.406: v267.97,74.93 266.7,76.2 255.27,76.2 254,74.93 207.01,74.93 196.22,85.72 80.64,85.72 v49.53,116.84
!INTERNAL_IO
  Top 0.406: E3.28 161.29,48.26 161.29,50.16 160.66,50.8 146.69,50.8 125.09,29.21 125.09,8.26 OMNIBUS.CL1
!INTERRUPT  (via drill 0.81)
  Top 0.406: v139.7,50.8 115.57,26.04 115.57,8.26 OMNIBUS.CP1
  Bottom 0.406: E3.27 166.37,52.07 140.97,52.07 v139.7,50.8
!LD_DEL  (via drill 0.81)
  Top 0.406: v185.42,152.4 E3.81
  Bottom 0.406: v185.42,152.4 189.23,156.21 E4.1
!LOAD_X  (via drill 0.81)
  Top 0.406: E5.16 E5.17 | v212.09,69.85 241.3,99.06 241.3,151.13 | E4.3 241.3,151.13 | 241.3,151.13 v192.41,201.29
  Bottom 0.406: E3.77 191.77,69.85 v212.09,69.85 | E5.16 123.82,201.29 v192.41,201.29
!LOAD_Y  (via drill 0.81)
  Top 0.406: v187.96,148.59 E3.79 | E7.16 143.51,177.8 v143.51,156.21
  Bottom 0.406: E7.16 E7.17 | v143.51,156.21 151.13,148.59 v187.96,148.59 E4.4
!MD3  (via drill 0.81)
  Top 0.406: v245.11,26.67 248.28,23.5 248.28,8.26 OMNIBUS.AP1
  Bottom 0.406: E3.50 186.69,44.45 177.16,44.45 176.53,43.81 176.53,36.83 175.9,36.83 175.26,36.2 175.26,26.67 v245.11,26.67
!MD4  (via drill 0.81)
  Top 0.406: v188.59,38.1 191.14,35.56 191.14,8.26 OMNIBUS.BK1
  Bottom 0.406: E3.44 181.61,41.91 181.61,39.37 187.33,39.37 v188.59,38.1
!MD5  (via drill 0.81)
  Top 0.406: v186.69,38.1 187.96,36.83 187.96,8.26 OMNIBUS.BL1
  Bottom 0.406: E3.41 180.34,38.1 v186.69,38.1
!MD6  (via drill 0.81)
  Top 0.406: v180.34,25.4 184.78,20.95 184.78,8.26 OMNIBUS.BM1
  Bottom 0.406: E3.40 173.99,41.91 173.99,25.4 v180.34,25.4
!MD7
  Top 0.406: E3.39 175.26,17.78 178.44,14.61 178.44,8.26 OMNIBUS.BP1
!MD8  (via drill 0.81)
  Top 0.406: v78.74,36.83 58.42,16.51 58.42,8.26 OMNIBUS.DK1
  Bottom 0.406: E3.22 100.97,55.88 81.91,36.83 v78.74,36.83
!MD9  (via drill 0.81)
  Top 0.406: v55.24,19.05 55.24,8.26 OMNIBUS.DL1
  Bottom 0.406: E3.21 166.37,57.15 93.34,57.15 v55.24,19.05
!MD10  (via drill 0.81)
  Top 0.406: v52.07,17.78 52.07,8.26 OMNIBUS.DM1
  Bottom 0.406: E3.20 92.71,58.42 v52.07,17.78
!MD11  (via drill 0.81)
  Top 0.406: v48.26,17.78 45.72,15.24 45.72,8.26 OMNIBUS.DP1
  Bottom 0.406: E3.18 91.44,60.96 v48.26,17.78
!NON_STORE  (via drill 0.81)
  Top 0.406: E3.80 186.69,69.85 v186.69,87
  Bottom 0.406: v186.69,87 169.55,104.14 64.13,104.14 44.45,123.83 44.45,125.09 47.62,128.27 49.53,128.27 49.53,148.59 J1.LL
!PAUSE  (via drill 0.81)
  Top 0.406: v151.13,36.83 144.15,29.84 144.15,8.26 OMNIBUS.CD1
  Bottom 0.406: E3.33 163.83,36.83 v151.13,36.83
!SKIP  (via drill 0.81)
  Top 0.406: v111.76,53.34 109.22,50.8 109.22,8.26 OMNIBUS.CS1
  Bottom 0.406: v111.76,53.34 E3.24
!WRITE_THRU  (via drill 0.81)
  Top 0.406: v200.66,50.8 204.47,54.61 v204.47,74.93 | v53.34,111.12 53.34,149.86 J1.JJ
  Bottom 0.406: v200.66,50.8 E3.60 | v204.47,74.93 194.94,84.45 80.01,84.45 v53.34,111.12
+15V  (via drill 0.81)
  Top 0.686: E8.8 128.27,175.26 128.27,180.34 130.81,182.88 v130.81,186.69 | v83.82,15.88 v83.82,18.41 | v91.44,189.23 91.44,53.34 81.28,43.18 81.28,36.83 C28.1
  Bottom 0.686: 114.3,186.69 v130.81,186.69 | E6.8 114.3,186.69 | C28.1 78.74,22.86 81.28,20.32 C43.+ v83.82,18.41 | v83.82,15.88 83.82,8.26 OMNIBUS.DA2 | 114.3,186.69 111.76,184.15 109.22,184.15 104.14,189.23 v91.44,189.23
-15V  (via drill 0.81)
  Top 0.686: C25.2 215.9,36.2 214.63,34.92 v214.63,24.13 v214.63,16.51 | v278.76,20.95 v282.57,17.14 | v203.2,158.75 210.82,151.13 C24.- | R84.1 R85.1 | v101.6,149.86 92.71,140.97 92.71,36.83 v80.01,24.13 v80.01,15.88
  Bottom 0.686: E6.4 133.35,181.61 137.16,177.8 140.34,177.8 140.97,177.16 140.97,166.37 | E8.4 140.97,166.37 | C24.- C25.2 | v214.63,16.51 213.36,15.24 213.36,8.26 OMNIBUS.BB2 | 150.5,24.13 150.5,8.26 OMNIBUS.CB2 | 150.5,24.13 v214.63,24.13 254,24.13 257.18,20.95 263.52,20.95 266.7,24.13 275.59,24.13 v278.76,20.95 | v282.57,17.14 283.21,17.14 283.21,8.26 OMNIBUS.AB2 | 140.97,166.37 143.51,163.83 198.12,163.83 v203.2,158.75 | R85.1 105.41,149.86 v101.6,149.86 | v80.01,15.88 80.01,8.26 OMNIBUS.DB2 | 150.5,24.13 v80.01,24.13
COLOR  (via drill 0.81 pad 0.25)
  Top 0.406: D2.A R8.1 | E2.1 259.08,82.55 260.35,83.82 265.43,83.82 266.7,82.55 v266.7,67.31
  Bottom 0.406: D2.A 245.11,116.84 245.11,93.98 E2.1 | v266.7,67.31 E2.10
D00
  Top 0.406: E3.2 181.61,69.85 181.61,198.75 178.44,201.93 95.25,201.93 83.82,190.5 J2.B
  Bottom 0.406: J2.B RN1.2 C16.1
D01  (via drill 0.81)
  Top 0.406: v90.17,80.01 87.63,82.55 87.63,181.61 J2.D
  Bottom 0.406: E3.4 176.53,69.85 176.53,80.01 v90.17,80.01 | J2.D RN1.3 C17.1
D02  (via drill 0.81)
  Top 0.406: E3.5 173.99,72.39 v173.99,158.75
  Bottom 0.406: v173.99,158.75 170.18,162.56 122.56,162.56 110.49,174.62 110.49,182.88 108.59,182.88 107.31,181.61 97.79,181.61 96.52,182.88 C18.1 RN1.4 J2.F
D03  (via drill 0.81)
  Top 0.406: v90.17,78.11 86.36,81.92 86.36,177.8 J2.J
  Bottom 0.406: E3.6 173.99,69.85 173.99,78.11 v90.17,78.11 | J2.J RN1.5 C19.1
D08  (via drill 0.81)
  Top 0.406: v86.36,71.12 85.09,72.39 85.09,166.37 J2.V
  Bottom 0.406: E3.8 171.45,69.85 171.45,72.39 166.37,72.39 165.1,71.12 v86.36,71.12 | J2.V 85.09,168.91 85.09,172.72 RN1.6 C20.1
D09  (via drill 0.81)
  Top 0.406: v83.82,69.85 82.55,71.12 82.55,163.83 J2.X
  Bottom 0.406: E3.9 168.91,69.85 v83.82,69.85 | J2.X 86.36,167.64 86.36,171.45 RN1.7 C21.1
D10  (via drill 0.81)
  Top 0.406: E3.10 168.91,69.85 v168.91,147.32
  Bottom 0.406: v168.91,147.32 141.6,147.32 131.44,157.48 85.72,157.48 84.45,158.75 83.19,158.75 82.55,159.38 82.55,161.29 J2.Z 87.63,166.37 87.63,170.18 RN1.8 C22.1
D11  (via drill 0.81)
  Top 0.406: E3.11 166.37,72.39 166.37,157.48 v165.1,158.75
  Bottom 0.406: v165.1,158.75 163.83,160.02 88.9,160.02 | J2.BB 88.9,160.02 | 88.9,160.02 88.9,168.91 RN1.9 C23.1
DEL_1
  Top 0.406: E15.6 104.14,113.03 104.14,194.31 S1.3
DI03  (via drill 0.81)
  Top 0.406: v123.19,180.34 121.92,181.61 E5.5 | v175.26,57.15 171.45,60.96 v171.45,119.38 | v146.05,144.78 138.43,152.4 138.43,175.26 E7.5
  Bottom 0.406: E7.5 133.98,179.71 128.91,179.71 128.27,180.34 v123.19,180.34 | E3.65 191.77,57.15 v175.26,57.15 | v146.05,144.78 v171.45,119.38
DI04  (via drill 0.81)
  Top 0.406: v125.73,179.07 124.46,180.34 E5.6 | v160.02,59.69 147.32,72.39 147.32,150.5 139.7,158.12 E7.6
  Bottom 0.406: E7.6 138.43,175.26 128.91,175.26 128.27,175.9 128.27,179.07 v125.73,179.07 | E3.67 169.55,58.42 168.28,59.69 v160.02,59.69
DI05  (via drill 0.81)
  Top 0.406: E3.68 196.85,62.23 v196.85,170.81
  Bottom 0.406: E7.7 143.51,177.8 146.69,177.8 147.32,178.44 147.32,179.07 | 147.32,179.07 147.32,182.88 144.15,182.88 143.51,183.51 143.51,190.5 128.27,190.5 E5.7 | v196.85,170.81 188.59,179.07 147.32,179.07
DI06  (via drill 0.81)
  Top 0.406: E7.8 144.78,179.71 140.97,183.51 140.97,187.32 133.98,194.31 129.54,194.31 E5.8 | v199.39,62.23 201.93,64.77 v201.93,161.93
  Bottom 0.406: E3.69 194.31,62.23 v199.39,62.23 | v201.93,161.93 188.59,175.26 146.05,175.26 E7.8
DI07  (via drill 0.81)
  Top 0.406: E7.9 146.05,177.8 v146.05,179.07 | v134.62,182.25 133.35,183.51 133.35,189.87 132.08,191.13 E5.9 | v199.39,166.37 v199.39,64.77
  Bottom 0.406: v146.05,179.07 142.88,182.25 v134.62,182.25 | E3.70 196.85,64.77 v199.39,64.77 | v199.39,166.37 187.96,177.8 148.59,177.8 E7.9
DI08  (via drill 0.81)
  Top 0.406: E7.10 151.13,177.8 v151.13,191.77 | E3.73 194.31,67.31 194.31,183.51 v186.06,191.77
  Bottom 0.406: E5.10 v151.13,191.77 v186.06,191.77
DI09  (via drill 0.81)
  Top 0.406: E5.11 148.59,185.42 | 148.59,185.42 E7.11 | v195.58,107.95 E3.74 | v158.75,144.78 148.59,154.94 148.59,185.42
  Bottom 0.406: v158.75,144.78 v195.58,107.95
DI10  (via drill 0.81)
  Top 0.406: E5.12 E7.12 | v193.04,180.34 E3.75
  Bottom 0.406: v193.04,180.34 190.5,182.88 148.59,182.88 E7.12
DI11  (via drill 0.81)
  Top 0.406: E7.13 142.24,186.69 142.24,187.32 130.18,199.39 E5.13 | E3.76 191.77,69.85 v191.77,184.15
  Bottom 0.406: v191.77,184.15 190.5,185.42 146.05,185.42 E7.13
GND  (via drill 0.81)
  Top 0.686: C6.2 C64.2 107.95,149.86 R86.1 | J2.E J2.H J2.K | J2.KK J2.MM | J1.EE J1.CC J1.AA | J1.HH J1.EE | J1.A J1.C | J1.K J1.M Y.1@2 | C65.2 C8.2 132.08,157.48 E8.3 134.62,168.91 E8.5 E7.3 E7.2 | C7.2 116.84,172.72 E6.3 119.38,184.15 E6.5 | E5.14 E5.15 E5.3 E5.2 | 271.14,16.51 Q1.1 275.59,24.13 280.67,29.21 280.67,39.37 C13.- | 271.14,16.51 271.14,8.26 OMNIBUS.AF2 | C4.2 246.38,157.48 246.38,143.51 E4.7 254,130.81 254,85.09 | 254,85.09 C2.2 | 254,85.09 254,67.31 E2.8 | 252.09,16.51 252.09,23.5 E1.8 257.81,29.21 C1.2 v255.27,50.8 230.5,50.8 230.5,40.64 | 252.09,16.51 v252.09,15.88 252.09,8.26 OMNIBUS.AN2 | 252.09,16.51 271.14,16.51 | v105.41,16.51 105.41,8.26 OMNIBUS.CT2 | v118.11,16.51 118.11,8.26 OMNIBUS.CN1 | v137.16,16.51 137.16,8.26 OMNIBUS.CF1 | C43.- 83.82,29.84 77.47,23.5 77.47,15.24 | 77.47,15.24 77.47,8.26 OMNIBUS.DC1 | 77.47,15.24 68.58,15.24 67.94,14.61 67.94,8.26 OMNIBUS.DF2 | v36.2,15.88 36.2,8.26 OMNIBUS.DT2 | v48.26,15.88 48.26,8.26 OMNIBUS.DN2 | v169.55,16.51 169.55,8.26 OMNIBUS.BT2 | E3.32 C11.2 | C15.- 152.4,27.94 147.32,22.86 v147.32,16.51 147.32,8.26 OMNIBUS.CC1 | E3.59 191.77,49.53 191.77,50.8 189.87,50.8 184.15,45.09 184.15,41.91 E3.47 186.69,39.37 200.66,39.37 200.66,38.1 | v200.66,16.51 200.66,8.26 OMNIBUS.BF2 | v200.66,16.51 200.66,38.1 | v210.82,16.51 210.82,8.26 OMNIBUS.BC1 | v200.66,16.51 v210.82,16.51 | C9.2 E3.7 173.99,69.85 173.99,60.33 177.8,56.52 E3.42 176.53,41.91 C10.2 176.53,23.5 181.61,18.41 181.61,8.26 OMNIBUS.BN2 | C25.1 218.44,36.83 218.44,40.64 | C5.2 218.44,45.09 | 218.44,45.09 218.44,40.64 | 218.44,40.64 230.5,40.64 | 230.5,40.64 C14.- 238.76,38.1 238.76,8.26 OMNIBUS.AT2
  Top 0.686: 200.66,38.1 214.63,38.1 214.63,41.27 218.44,45.09 | RN1.10 88.9,168.91 v88.9,193.04 | C23.2 C22.2 C21.2 C20.2 C19.2 C18.2 C17.2 C16.2 | J1.EE 48.26,158.75 Z.1@2 | v210.82,16.51 C24.+
  Bottom 0.686: E15.7 104.14,110.49 104.14,124.46 | 104.14,124.46 105.41,125.73 C6.2 | 104.14,124.46 C3.2 | J2.K J2.M J2.P J2.S J2.U J2.W J2.Y J2.AA J2.CC J2.EE J2.HH J2.KK | J2.MM J2.PP | J2.E J2.C J2.A 86.36,193.04 v88.9,193.04 113.03,193.04 E5.2 | J1.AA J1.Y J1.W | J1.AA J1.BB | J1.PP J1.MM J1.KK J1.HH | J1.E 48.26,181.61 | 48.26,181.61 J1.H | J1.H J1.J J2.H | J1.E J1.F | J1.E J1.C | J1.N J1.M J1.P J1.S J1.U | J1.U J1.W | J1.U J1.V | J1.K J1.H | ISP.10 170.81,197.49 170.81,198.12 | 170.81,198.12 170.81,200.03 183.52,200.03 185.42,198.12 185.42,195.58 | ISP.2 185.42,195.58 | E7.14 E7.15 134.62,189.23 E6.5 E5.3 | 170.81,198.12 128.27,198.12 E5.14 | E8.3 130.81,165.1 121.92,165.1 C7.2 | R86.1 110.49,149.86 123.82,149.86 126.37,147.32 132.08,147.32 C65.2 | 250.83,15.24 239.4,15.24 239.4,8.26 OMNIBUS.AT2 | 250.83,15.24 251.46,14.61 251.46,8.26 OMNIBUS.AN2 | 270.51,15.24 270.51,8.26 OMNIBUS.AF2 | 250.83,15.24 252.09,15.24 | 252.09,15.24 270.51,15.24 | 270.51,15.24 280.03,15.24 280.03,8.26 OMNIBUS.AC2 | E2.9 E2.8 255.27,63.5 v255.27,50.8 | v252.09,15.88 252.09,15.24 | v105.41,16.51 105.41,8.26 OMNIBUS.CT2 | v118.11,16.51 v105.41,16.51 | v118.11,16.51 118.11,8.26 OMNIBUS.CN1 | v137.16,16.51 137.16,8.26 OMNIBUS.CF1 | v118.11,16.51 v137.16,16.51 | v137.16,16.51 v147.32,16.51 147.32,8.26 OMNIBUS.CC1 | C43.- C28.2 74.3,36.2 74.3,17.14 | 36.2,15.24 36.2,8.26 OMNIBUS.DT2 | 36.2,15.24 v36.2,15.88 | 47.62,15.24 36.2,15.24 | 47.62,15.24 48.26,14.61 48.26,8.26 OMNIBUS.DN2 | 47.62,15.24 v48.26,15.88 | 67.31,15.24 67.31,8.26 OMNIBUS.DF2 | 47.62,15.24 67.31,15.24 | 67.31,15.24 74.3,15.24 | 74.3,15.24 76.84,15.24 76.84,8.26 OMNIBUS.DC1 | 74.3,15.24 74.3,17.14
  Bottom 0.686: v105.41,16.51 102.23,19.68 87,19.68 84.45,17.14 74.3,17.14 | OMNIBUS.BT2 169.55,8.26 v169.55,16.51 181.61,16.51 | 181.61,16.51 181.61,8.26 OMNIBUS.BN2 | v210.82,16.51 210.82,8.26 OMNIBUS.BC1 | v210.82,16.51 C24.+ | v200.66,16.51 200.66,8.26 OMNIBUS.BF2 | v210.82,16.51 v200.66,16.51 | v200.66,16.51 181.61,16.51 | C15.- 154.94,43.18 C11.2 | E3.32 166.37,41.91 168.28,41.91 168.91,42.55 168.91,48.26 E3.59 | E3.19 191.14,60.96 192.41,59.69 198.75,59.69 200.66,61.59 | 200.66,61.59 C12.2 E3.72 194.31,67.31 186.69,67.31 E3.82 | 200.66,61.59 206.38,55.88 C5.2 | C10.2 177.8,36.83 213.36,36.83 C25.1 | 185.42,195.58 220.98,160.02 243.84,160.02 C4.2 | RN1.10 97.79,167.64 C23.2 | X.1 X.1@2 44.45,191.77 J1.A | Z.1@2 Z.1 Z.1@1 | Y.1@2 Y.1 | J1.AA J1.W | J1.W Y.1@1 | 48.26,181.61 X.1@1
GRN_DELAY  (via drill 0.81)
  Top 0.406: TP2.TP 276.86,190.5 276.86,81.28 v273.05,77.47
  Bottom 0.406: E3.1 182.88,73.66 262.89,73.66 E2.13 265.43,73.66 271.78,73.66 273.05,74.93 v273.05,77.47
INITIALIZE
  Top 0.406: E3.25 166.37,52.07 138.43,52.07 113.03,26.67 113.03,15.24 112.4,14.61 112.4,8.26 OMNIBUS.CR1
INTENS  (via drill 0.81)
  Top 0.406: S1.2 102.87,193.04 v102.87,147.32
  Bottom 0.406: R79.1 R78.1 132.08,143.51 106.68,143.51 v102.87,147.32
N$1
  Top 0.406: E6.2 114.3,182.88 C41.2
  Bottom 0.406: E5.1 109.22,189.23 C41.2
N$2
  Top 0.406: R3.1 R5.1 R2.2 120.65,180.34 120.65,190.5 118.11,190.5 E6.6
N$3
  Top 0.406: C41.1 R2.1 | C41.1 110.49,181.61 | 110.49,181.61 E6.1 | E5.20 110.49,198.12 107.95,195.58 107.95,182.88 C41.1 | 110.49,181.61 C41.1
N$4
  Bottom 0.406: C39.1 256.54,195.58 DELAY.1
N$5
  Bottom 0.406: E8.2 129.54,167.64 C42.2 124.46,173.99 E7.1
N$6
  Top 0.406: R11.1 R12.1 R6.2
  Bottom 0.406: E8.6 132.08,168.28 133.35,167 133.35,165.1 R6.2
N$7
  Top 0.406: R6.1 C42.1 125.73,166.37 | 125.73,166.37 E8.1 | E7.20 127,178.44 125.73,177.16 125.73,166.37
N$27  (via drill 0.81)
  Top 0.406: D1.A 129.54,80.01 v154.94,54.61
  Bottom 0.406: v154.94,54.61 189.23,54.61 E3.61 | D1.A R1.1
N$28
  Top 0.406: R18.1 129.54,121.92 D1.C
  Bottom 0.406: E15.11 C40.1 123.19,124.46 R18.1
N$29
  Bottom 0.406: E15.10 115.57,114.3 C40.2
N$30
  Top 0.406: R19.1 271.78,96.52 C34.2
  Bottom 0.406: E2.15 269.24,80.01 C34.2 C35A.2 C35.2
N$31
  Bottom 0.406: R20.1 246.38,67.31 248.92,67.31 | E2.7 248.92,67.31 | 248.92,67.31 C33.2
N$32  (via drill 0.81 pad 0.25)
  Top 0.406: C33.1 v248.92,71.12
  Bottom 0.406: v248.92,71.12 250.19,69.85 E2.6
N$33  (via drill 0.81)
  Top 0.406: C34.1 271.78,73.66 v267.97,77.47
  Bottom 0.406: v267.97,77.47 E2.14 | C34.1 C35A.1 C35.1
N$35
  Bottom 0.406: E3.54 215.27,43.18 219.08,39.37 259.08,39.37 260.35,38.1 E1.13
N$36
  Bottom 0.406: E1.15 266.7,45.72 275.59,45.72 C36.2 279.4,41.91 R4.1
N$37
  Bottom 0.406: E1.14 267.97,44.45 C36.1
N$38
  Bottom 0.406: Q1.2 278.13,28.57 R14.2
N$39
  Top 0.406: 273.05,27.94 E1.9 | R15.1 273.05,27.94 | Q1.3 274.32,26.67 273.05,27.94
N$40
  Top 0.406: E1.11 E1.10 R22.1
N$41
  Top 0.406: R7.1 C37.2 E1.7
N$42
  Bottom 0.406: C37.1 254,33.02 E1.6
N$44
  Top 0.406: R9.1 219.71,144.78 D2.C
  Bottom 0.406: W3.1 234.95,153.67 220.98,153.67 D2.C
N$45
  Top 0.406: DELAY.2 252.73,181.61 252.73,149.86 E4.11
  Bottom 0.406: E4.11 245.11,142.24 W3.2 W4.1
N$46
  Top 0.406: R10.1 232.41,148.59 W4.2
N$48
  Top 0.406: C38.1 262.89,158.75 269.24,165.1 DELAY.3
N$49
  Top 0.406: C39.2 262.89,143.51 C38.2
  Bottom 0.406: E4.10 254,143.51 C39.2
N$153
  Bottom 0.406: R79.2 143.51,135.89 Q31.2 C63.1
N$154
  Top 0.406: C63.2 134.62,133.35 134.62,142.88 128.91,148.59 Q14.2
  Bottom 0.406: W5.2 W8.2 128.27,129.54 R83.1 C63.2 134.62,130.81 143.51,130.81 Q31.3 | Q14.2 127,154.94 120.65,154.94 R84.2
N$156
  Top 0.406: C65.1 Q14.3
  Bottom 0.406: R85.2 121.92,151.13 Q14.3
N$157
  Top 0.406: Q13.1 R87.1 R86.2
  Bottom 0.406: Q14.1 121.92,148.59 R87.1
N$158
  Bottom 0.406: R80.2 W5.1
N$159
  Bottom 0.406: R81.2 W8.1
N$160
  Top 0.406: R83.2 116.84,135.89 Q13.2
N$162
  Bottom 0.406: C64.1 Q13.3 119.38,135.89 R82.1
RED_DELAY
  Top 0.406: E2.5 255.27,73.66 255.27,83.82 258.44,83.82 265.43,90.17 270.51,95.25 270.51,189.23 TP1.TP
  Bottom 0.406: E3.83 184.15,72.39 E2.5
SET_DONE  (via drill 0.81)
  Top 0.406: v254,41.91 254,38.1 E1.5 | v191.77,46.99 190.5,45.72 E3.52
  Bottom 0.406: v254,41.91 248.92,46.99 v191.77,46.99
TCK
  Top 0.406: E3.62 194.31,54.61 184.15,54.61 184.15,196.85 ISP.1
TDI  (via drill 0.81)
  Top 0.406: v162.56,66.04 162.56,187.96 ISP.9
  Bottom 0.406: v162.56,66.04 E3.14
TDO  (via drill 0.81)
  Top 0.406: v177.8,63.5 176.53,64.77 176.53,192.41 179.07,194.94 179.07,196.85 ISP.3
  Bottom 0.406: v177.8,63.5 E3.71
TMS
  Top 0.406: E3.23 166.37,57.15 166.37,64.14 165.74,64.77 163.83,64.77 163.83,182.25 176.53,194.94 176.53,196.85 ISP.5
TP3  (via drill 0.81)
  Top 0.406: v149.22,46.99 135.89,33.66 v135.89,15.24
  Bottom 0.406: E3.29 166.37,46.99 v149.22,46.99 | v135.89,15.24 135.25,15.24 134.62,14.61 134.62,8.26 OMNIBUS.CH2
VCC  (via drill 0.81)
  Top 0.686: E7.19 128.27,185.42 128.27,200.66 118.11,200.66 E5.18 E5.19 113.03,200.66 108.59,200.66 106.68,198.75 | R3.2 C7.1 | C7.1 121.92,158.75 R11.2 C8.1 123.19,154.94 123.19,130.81 | C3.1 48.26,127 J1.UU | 143.51,130.81 143.51,133.35 144.78,134.62 Q31.1 | 143.51,130.81 R81.1 | C6.1 E15.14 115.57,121.92 123.19,121.92 | 127,116.84 127,119.38 123.19,121.92 | 127,116.84 R18.2 | 123.19,121.92 123.19,130.81 | 123.19,130.81 129.54,130.81 | 129.54,130.81 129.54,133.35 R82.2 | 129.54,130.81 143.51,130.81 | 106.68,198.75 106.68,173.99 C7.1 | J3.1 154.31,41.91 v154.31,22.23 | J4.1 179.07,33.66 v179.07,22.86 | R4.2 273.05,36.83 R15.2 R22.2 E1.16 C1.1 265.43,49.53 265.43,69.85 | C5.1 243.84,74.93 R20.2 | R8.2 R9.2 R10.2 | E2.2 E2.3 | RN1.1 98.43,198.75 106.68,198.75 | E2.11 265.43,69.85 | 265.43,69.85 265.43,81.28 E2.16 | R1.2 132.08,119.38 129.54,116.84 127,116.84
  Bottom 0.686: ISP.4 178.44,193.68 134.62,193.68 131.44,196.85 116.84,196.85 E5.19 | J1.UU J1.SS | R81.1 R80.1 | Q31.1 144.78,140.97 R78.2 | C3.1 48.26,127 81.28,127 | 81.28,127 113.03,127 C6.1 | 217.81,16.51 217.17,15.88 217.17,8.26 OMNIBUS.BA2 | 217.81,16.51 220.98,19.68 235.59,19.68 C14.+ 236.86,19.68 286.38,19.68 | OMNIBUS.CA2 153.03,8.26 153.03,20.32 C15.+ v154.31,22.23 178.44,22.23 v179.07,22.86 211.46,22.86 217.81,16.51 | R4.2 279.4,22.86 C13.+ 286.38,22.86 286.38,19.68 | R7.2 E1.3 E1.2 259.08,45.72 E1.16 | 286.38,19.68 286.38,8.26 OMNIBUS.AA2 | C4.1 251.46,157.48 | 251.46,157.48 E4.14 | R10.2 227.33,158.75 242.57,158.75 243.84,157.48 248.28,157.48 | 248.28,157.48 251.46,157.48 | C2.1 E2.16 259.08,82.55 E2.2 255.27,81.28 245.11,81.28 R20.2 | C2.1 R19.2 | 248.28,149.86 248.28,157.48 | 248.28,149.86 253.37,149.86 264.16,139.06 C2.1 | R11.2 132.72,158.75 133.98,157.48 R8.2 | J2.SS J2.UU 81.28,127 | E7.19 E7.18 | E15.5 113.03,106.68 124.46,106.68 R18.2 | E4.5 244.47,146.05 248.28,149.86
VCCINT
  Top 0.686: C9.1 179.07,72.39 E3.3 179.07,69.85 179.07,41.91 E3.43 J4.2 182.88,36.2 C10.1
VCCIO
  Top 0.686: C11.1 160.02,48.26 160.66,47.62 J3.2 168.91,46.99 | 168.91,46.99 E3.38 | E3.13 168.91,67.31 168.91,46.99 | E3.53 191.77,41.91 191.77,43.81 192.41,44.45 199.39,44.45 199.39,58.42 C12.1 | E3.78 191.77,67.31 191.77,60.33 192.41,59.69 195.58,59.69 E3.66
  Bottom 0.686: E3.26 163.83,49.53 C11.1 | E3.66 199.39,58.42 C12.1 | E3.13 168.91,67.31 178.44,67.31 179.07,67.94 179.07,69.85 189.23,69.85 E3.78
X_ANALOG
  Top 0.406: R5.2 111.76,176.53 115.57,180.34 115.57,187.96 E6.7
  Bottom 0.406: X.2 49.53,186.69 J1.D 54.61,181.61 94.62,181.61 97.16,179.07 106.68,179.07 R5.2
Y_ANALOG
  Top 0.406: R12.2 128.27,165.1 128.27,172.72 E8.7
  Bottom 0.406: Y.2 41.91,176.53 49.53,176.53 J1.L 52.07,179.07 94.62,179.07 97.16,176.53 100.97,176.53 116.21,161.29 R12.2
Z_AXIS
  Bottom 0.406: R87.2 67.31,148.59 57.15,158.75 | J1.X 57.15,158.75 | Z.2 40.64,158.75 57.15,158.75

### Text on the board
Top: + | + | + | + | +
Bottom: SIDE 2 | V2 | Space War | VC8E+Input
Dimension: LEDGE
tPlace: + | - | L | S